# EAGLE schematic Lycans_circuit_protection_v10 (EAGLE 9.7.0)
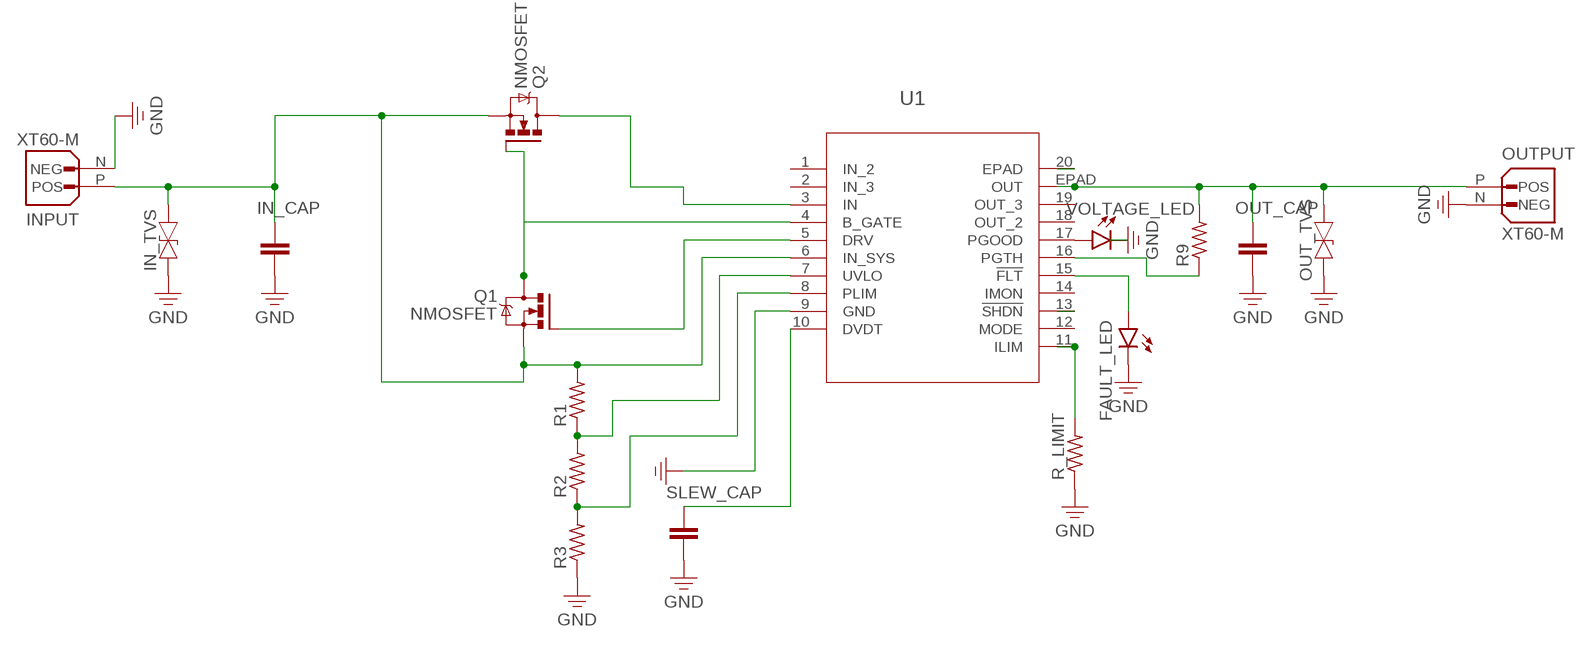
[diagram p0: schematic, sheet 1]

## Parts
FAULT_LED  LED_WHITE  LED_RADIAL_WHITE  [LEDRD254W60D565H860B_W]
IN_CAP  CC0805KRX7R9BB104  [CAP_0805]
IN_TVS  TVS_SMAJ*_DO-214AC(SMA)  [DIOM5226X290N]
INPUT  XT60-M  [AMASS_XT60-M]
OUT_CAP  CC0805KRX7R9BB104  [CAP_0805]
OUT_TVS  TVS_SMAJ*_DO-214AC(SMA)  [DIOM5226X290N]
OUTPUT  XT60-M  [AMASS_XT60-M]
Q1  NMOSFET  NMOSFET_SOT23  [SOT23]
Q2  NMOSFET  NMOSFET_SOT23  [SOT23]
R1  CRCW08050000Z0EA  [RES_0805]
R2  CRCW08050000Z0EA  [RES_0805]
R3  CRCW08050000Z0EA  [RES_0805]
R9  CRCW08050000Z0EA  [RES_0805]
R_LIMIT  CRCW08050000Z0EA  [RES_0805]
SLEW_CAP  CC0805KRX7R9BB104  [CAP_0805]
U1  TPS26636PWPRHTSSOP20_PWP_TEX-M  [HTSSOP20_PWP_TEX-M]
VOLTAGE_LED  LED_WHITE  LED_RADIAL_WHITE  [LEDRD254W60D565H860B_W]

## Nets
GND: FAULT_LED.2(C) IN_CAP.2 IN_TVS.1 INPUT.N(NEG) OUT_CAP.2 OUT_TVS.1 OUTPUT.N(NEG) R3.1 R_LIMIT.1 SLEW_CAP.2 U1.9(GND) VOLTAGE_LED.2(C)
N$1: IN_CAP.1 IN_TVS.2 INPUT.P(POS) Q1.2(S) Q2.2(S) R1.2 U1.6(IN_SYS)
N$2: R_LIMIT.2 U1.11(ILIM)
N$3: Q2.3(D) U1.3(IN)
N$4: SLEW_CAP.1 U1.10(DVDT)
N$5: Q1.1(G) U1.5(DRV)
N$6: R1.1 R2.2 U1.7(UVLO)
N$7: R2.1 R3.2 U1.8(PLIM)
N$8: U1.20(EPAD)
N$9: U1.17(PGOOD) VOLTAGE_LED.1(A)
N$10: FAULT_LED.1(A) U1.15(!FLT)
N$11: R9.1 U1.16(PGTH)
N$13: Q1.3(D) Q2.1(G) U1.4(B_GATE)
N$14: OUT_CAP.1 OUT_TVS.2 OUTPUT.P(POS) R9.2 U1.EPAD(OUT)
N$15: U1.13(!SHDN)
Unconnected: U1.12(MODE) U1.14(IMON)

## Power pins joined to a net without a drawn wire
IN_2: U1.1(IN_2)
IN_3: U1.2(IN_3)
OUT_2: U1.18(OUT_2)
OUT_3: U1.19(OUT_3)

## Library data of the parts
FAULT_LED VOLTAGE_LED = Tinkercad:LED_RADIAL: LED - Generic; CATEGORY: Opto-Electronic; SUB-CATEGORY: LED
IN_CAP OUT_CAP SLEW_CAP = Resistor_Capacitor:CC0805KRX7R9BB104: CAP CER 0.1UF 50V X7R 0805 Manufacturer's datasheet <http://www.yageo.com/documents/recent/UPY-GPHC_X7R_6.3V-to-50V_18.pdf>; CREATED_BY: PCBLayout.com; DIGIKEY_PART_NUMBER: 311-1140-2-ND; MANUFACTURER: Yageo; MPN: CC0805KRX7R9BB104; PACKAGE: SMD 0805
IN_TVS OUT_TVS = Circuit-Protection:TVS_: TVS Diode - Popular parts; CATEGORY: Circuit Protection; PACKAGE_SIZE: DO-214AC; PACKAGE_TYPE: Surface Mount; SERIES: SMAJ; SUBCATEGORY: TVS Diode
INPUT OUTPUT = XT60-M:XT60-M: Check availability <https://pricing.snapeda.com/parts/XT60-M/AMASS/view-part?ref=eda>; AVAILABILITY: Not in stock; CHECK_PRICES: https://www.snapeda.com/parts/XT60-M/AMASS/view-part/?ref=eda; DESCRIPTION: Plug; DC supply; XT60; male; PIN: 2; for cable; soldered; 30A; 500V; MF: AMASS; MP: XT60-M; PACKAGE: Package; PRICE: None; SNAPEDA_LINK: https://www.snapeda.com/parts/XT60-M/AMASS/view-part/?ref=snap
Q1 Q2 = Tinkercad:NMOSFET: N-Channel MOSFET - Generic; CATEGORY: Transistor; SUB-CATEGORY: MOSFET; TYPE: N-Channel
R1-R3 R9 R_LIMIT = Resistor_Capacitor:CRCW08050000Z0EA: RES SMD 0 OHM JUMPER 1/8W 0805 Manufacturer's datasheet <http://www.vishay.com/docs/20035/dcrcwe3.pdf>; CREATED_BY: PCBLayout.com; DIGIKEY_PART_NUMBER: 541-0.0ATR-ND; MANUFACTURER: Vishay Dale; MPN: CRCW08050000Z0EA; PACKAGE: SMD 0805
U1 = TPS26636PWPT:TPS26636PWPR; COPYRIGHT: Copyright (C) 2025 Ultra Librarian. All rights reserved.; DATASHEET: https://www.ti.com/lit/gpn/tps2663; DESCRIPTION: 4.5-V to 60-V, 31mΩ, 0.6-6A eFuse with output power limiting and surge protection 20-HTSSOP -40 to 125; MANUFACTURER_NAME: Texas Instruments; MANUFACTURER_PART_NUMBER: TPS26636PWPR; TYPE: Power Management